# Altium schematic sheet E17-04_IMD.SchDoc
size A; DocumentNumber: 12; SheetNumber: 12; SheetTotal: 18
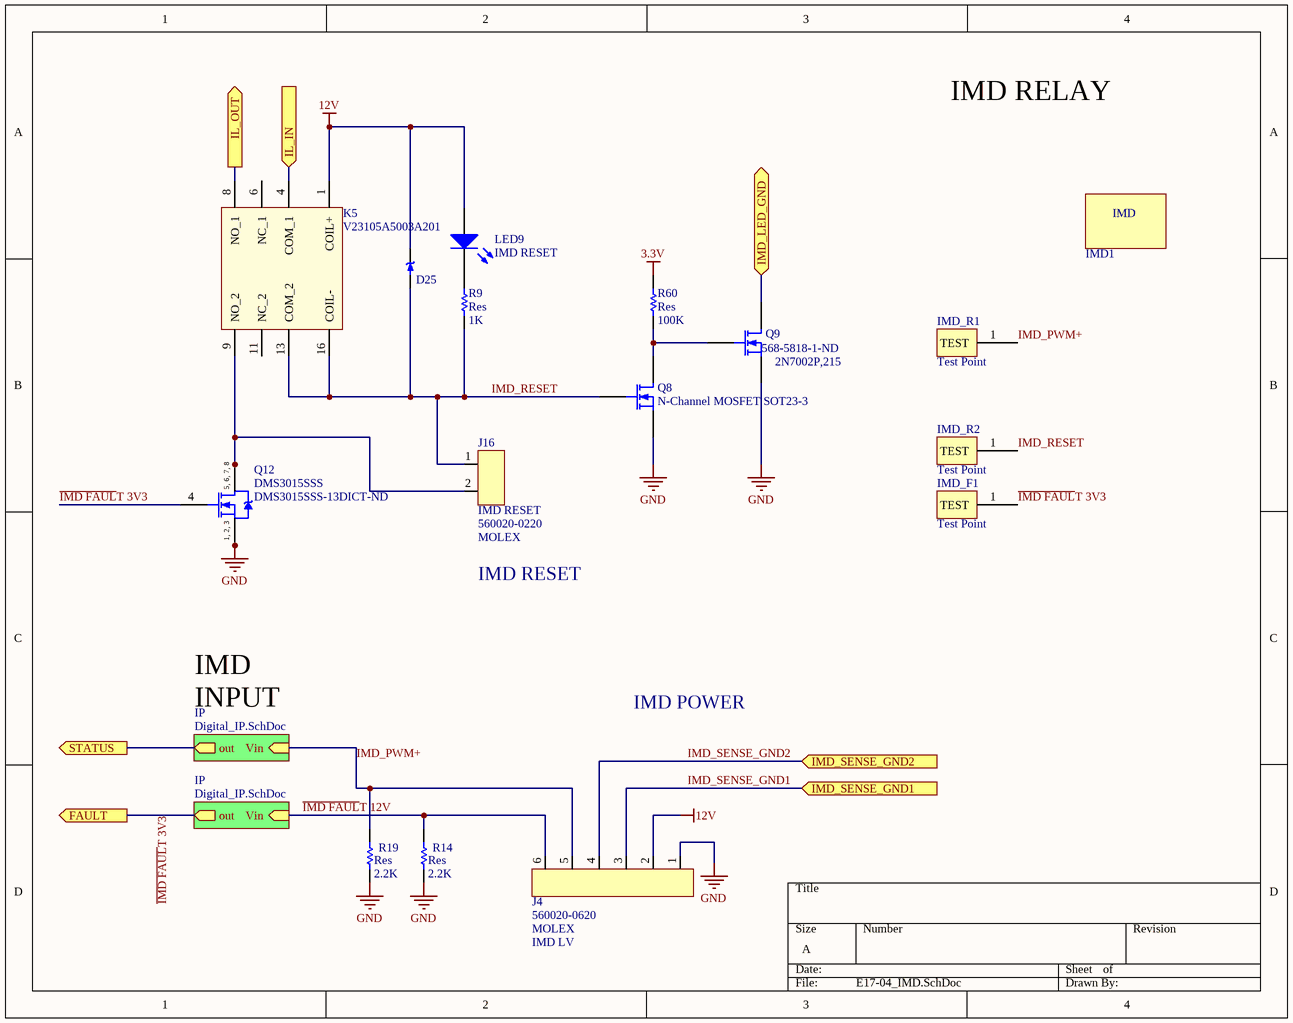
[diagram p0: E17-04_IMD.SchDoc]

## Parts
D25  PMEG4010ET  [SOT23-3]  (value not drawn)
IMD1  ISOMETER IR155-3203  [ISOMETER_IR155]  (value not drawn)
IMD_F1  Test Point  [TEST POINT 5000K]
IMD_R1  Test Point  [TEST POINT 5000K]
IMD_R2  Test Point  [TEST POINT 5000K]
J4  IMD LV  MANUFACTURER: MOLEX  [MOLEX_DURACLIK_6 NAT VERT]
J16  IMD RESET  MANUFACTURER: MOLEX  [MOLEX_DURACLIK_2 NAT VERT]
K5  MFG_PN: V23105A5003A201  [K_V23105A5003A201]  (hidden comment: K_V23105A5003A201)
LED9  IMD RESET  [155124VS73200]
Q8  N-Channel MOSFET SOT23-3  [SOT23-3]
Q9  2N7002P,215  Supplier Part Number 1: 568-5818-1-ND  [SOT23-3]
Q12  DMS3015SSS  Supplier Part Number 1: DMS3015SSS-13DICT-ND  [SOIC-8-150]
R9  Res  value 1K  [2012[0805]]
R14  Res  value 2.2K  [2012[0805]]
R19  Res  value 2.2K  [2012[0805]]
R60  Res  value 100K  [2012[0805]]

## Sub-sheets
IP = Digital_IP.SchDoc: Vin (in), out (out)
IP = Digital_IP.SchDoc: Vin (in), out (out)

## Ports
FAULT (out), IL_IN (in), IL_OUT (out), IMD_LED_GND, IMD_SENSE_GND1 (in), IMD_SENSE_GND2 (in), STATUS (out)

## Nets
3.3V: R60.1
12V: D25.3 J4.2 K5.1(COIL+) LED9.2
GND: J4.1 Q8.2(S) Q9.2(S) Q12.1(S) Q12.2(S) Q12.3(S) R14.2 R19.2
~{IMD FAUL}T 3V3: IMD_F1.1(TEST) Q12.4(G) ; port FAULT, sheet IP/out
~{IMD FAUL}T 12V: J4.6 R14.1 ; sheet IP/Vin
IL_IN: K5.4(COM_1) ; port IL_IN
IL_OUT: K5.8(NO_1) ; port IL_OUT
IMD_LED_GND: Q9.3(D) ; port IMD_LED_GND
IMD_PWM+: IMD_R1.1(TEST) J4.5 R19.1 ; sheet IP/Vin
IMD_RESET: D25.1 IMD_R2.1(TEST) J16.1 K5.13(COM_2) K5.16(COIL-) Q8.1(G) R9.2
IMD_SENSE_GND1: J4.3 ; port IMD_SENSE_GND1
IMD_SENSE_GND2: J4.4 ; port IMD_SENSE_GND2
STATUS: port STATUS, sheet IP/out
NetJ16_2: J16.2 K5.9(NO_2) Q12.5(D) Q12.6(D) Q12.7(D) Q12.8(D)
NetLED9_1: LED9.1 R9.1
NetQ8_3: Q8.3(D) Q9.1(G) R60.2

Not connected (* = marked no-connect by the designer): K5 6(NC_1) 11(NC_2)

## Notes on the sheet
- IMD RELAY
- IMD RESET
- IMD
  INPUT
- IMD POWER
- (in symbol Bender ISOMETER IR155-3203) IMD
- (in symbol DMS3015SSS) 5, 6, 7, 8; 1, 2, 3

## Library data of the parts
D25 = PMEG4010ET: SCHOTTKY RECT 40V 1A SOT-23; Supplier 1: Digi-Key; Supplier Part Number 1: 568-4103-6-ND
IMD1 = Bender ISOMETER IR155-3203
IMD_F1 IMD_R1 IMD_R2 = Test Point: 5000-5004, 5015-5019 Keystone Electronics
J4 = 560020-0620: MOLEX DURACLIK 6-PIN VERT NAT; POSITIONS: 6; UL: 94V-0; VOLTAGE: 125; CURRENT: 3; PLATING: Tin (Sn); Digikey_PN: Not in production; COLOR: NAT; SERIES: Duraclik; ORIENTATOIN: VERT; MPN: 560020-0620
J16 = 560020-0220: MOLEX DURACLIK 2-PIN VERT NAT; POSITIONS: 2; UL: 94V-0; VOLTAGE: 125; CURRENT: 3; PLATING: Tin (Sn); Digikey_PN: Not in production; COLOR: NAT; SERIES: Duraclik; ORIENTATOIN: VERT; MPN: 560020-0220; Comment_1: 560020-0220
K5 = K_V23105A5003A201: RELAY DPDT 12V/12.5mA, 220V/3A; MFG: TE; DIGIKEY_PN: PB384-ND
LED9 = 155124VS73200: Right Angle SMD Green 2V; Manufacturer: Wurth Electronics Inc; Lens Color: Colorless; Lens Transparency: Clear; Millicandela Rating: 50mcd; Lens Style/Size: Rectangle with Domed Top, 2.00mm x 1.00mm; Current - Test: 20mA; Viewing Angle: 120°; Wavelength - Dominant: 573nm; Wavelength - Peak: 575nm; Supplier 1: Digi-Key; Supplier Part Number 1: 732-5026-1-ND; RoHS: RoHS Compliant; Category: Optoelectronics; Stock 1: 4820; Pricing 1: 1=0.44, 50=0.3802, 100=0.3476, 500=0.31498, 1000=0.29326 (CAD); Packaging: Cut Tape (CT); Color: Green; Voltage - Forward (Vf) (Typ): 2V; Mounting Type: Surface Mount, Right Angle; Features: -; Package / Case: 2-SMD, Side View; Supplier Device Package: 1204; Size / Dimension: 3.20mm L x 1.50mm W; Height (Max): 1.20mm; ComponentLink1URL: http://katalog.we-online.de/led/datasheet/155124VS73200.pdf; ComponentLink1Description: http://katalog.we-online.de/led/datasheet/155124VS73200.pdf; Manufacturer Part Number: 155124VS73200
Q8 = MOSFET-N SOT23-3
Q9 = 2N7002P,215: N-Channel Enhancement Mode Vertical DMOS FET; PackageReference: SOT23; PackageDescription: SOT-23; 3 Leads; Body 3.1 x 2.5 mm, inc. leads (LxW max), Alternate Lead Configuration; Supplier 1: Digi-Key
Q12 = DMS3015SSS: N-Channel Power MOSFET; Supplier 1: Digi-Key
R9 R14 R19 R60 = Res: Surface Mount Resistor; Published: 8-Jun-2000; LatestRevisionDate: 17-Jul-2002; LatestRevisionNote: Re-released for DXP Platform.; PackageReference: AXIAL-0.5; Publisher: Altium Limited